# EAGLE design CMM.PCB.v1.0 (EAGLE 9.6.2)
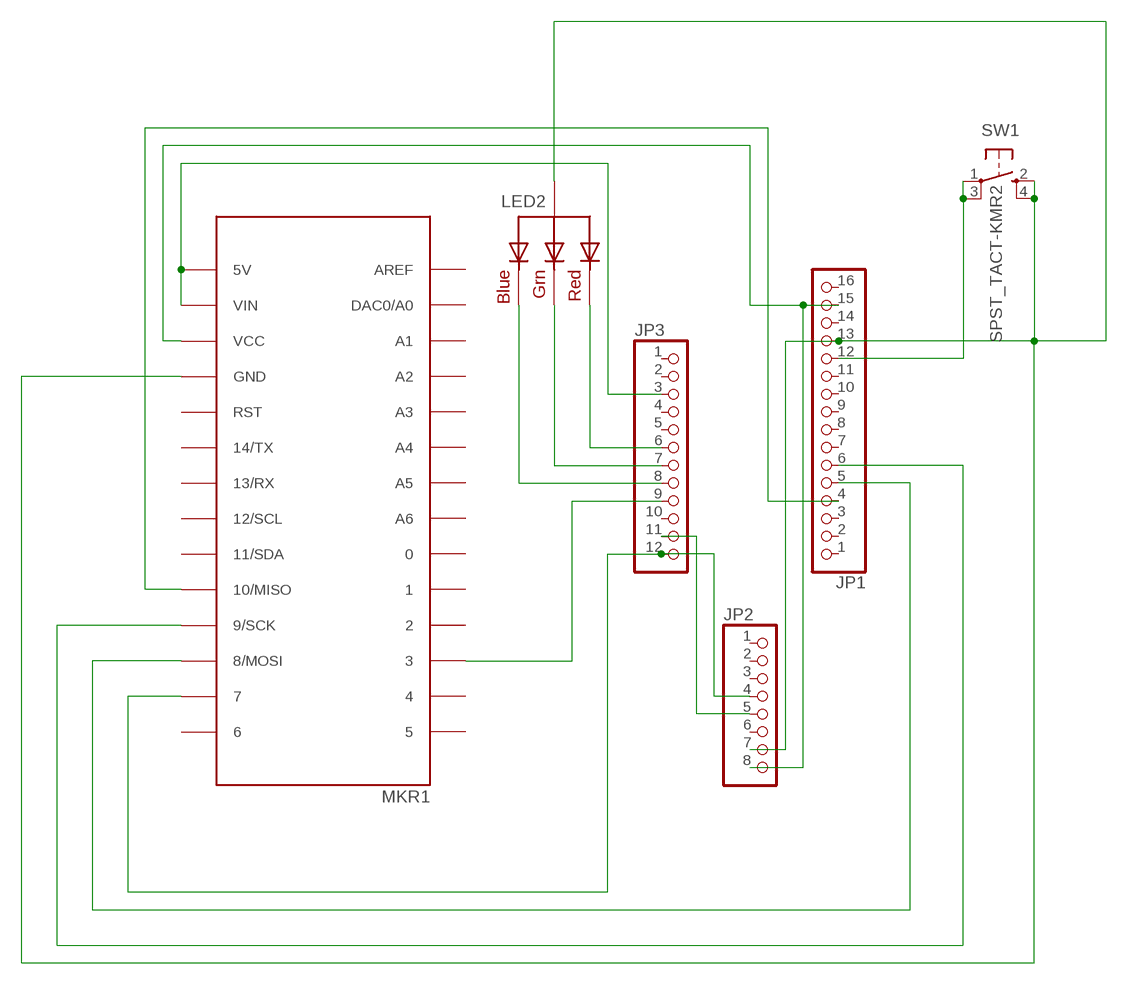
[diagram p0: schematic, sheet 1]

## Parts
JP1  HEADER-1X16ROUND  [1X16_ROUND]
JP2  HEADER-1X870MIL  [1X08_ROUND_70]
JP3  HEADER-1X12  [1X12_ROUND]
LED2  RGBLED_CA-5MM  [LED5MMRGB]
MKR1  -  ARDUINO-UTILITY_MKRBOARDOUTLINE  [ARDUINO-UTILITY_MKRBOARD]
SW1  SPST_TACT-KMR2  [KMR2]

## Nets
GND: JP1.13 JP2.7 LED2.2(VCC) MKR1.GND SW1.2(S) SW1.4(S1)
N$1: JP3.9 MKR1.3
N$2: JP2.4 JP3.12 MKR1.7
N$3: JP1.5 MKR1.8(8/MOSI)
N$4: JP1.6 MKR1.9(9/SCK)
N$5: JP1.4 MKR1.10(10/MISO)
N$6: JP1.15 JP2.8 MKR1.VCC
N$7: JP3.3 MKR1.5V MKR1.VIN
N$8: JP3.6 LED2.1(RED)
N$9: JP2.5 JP3.11
N$10: JP3.7 LED2.3(GREEN)
N$11: JP3.8 LED2.4(BLUE)
SIGNAL: JP1.12 SW1.1(P) SW1.3(P1)
Unconnected: JP1.1 JP1.2 JP1.3 JP1.7 JP1.8 JP1.9 JP1.10 JP1.11 JP1.14 JP1.16 JP2.1 JP2.2 JP2.3 JP2.6 JP3.1 JP3.2 JP3.4 JP3.5 JP3.10 MKR1.0 MKR1.1 MKR1.2 MKR1.4 MKR1.5 MKR1.6 MKR1.11(11/SDA) MKR1.12(12/SCL) MKR1.13(13/RX) MKR1.14(14/TX) MKR1.A0(DAC0/A0) MKR1.A1 MKR1.A2 MKR1.A3 MKR1.A4 MKR1.A5 MKR1.A6 MKR1.AREF MKR1.RST

## Library data of the parts
JP1 = microbuilder:HEADER-1X16: PIN HEADER
JP2 = microbuilder:HEADER-1X8: PIN HEADER
JP3 = microbuilder:HEADER-1X12
LED2 = adafruit:RGBLED_CA: RGB LED, common-anode 5MM Staggered pins 5mm Piranha package http://www.ladyada.net/library/pcb/eaglelibrary.html
MKR1 = adafruit:ARDUINO-UTILITY_MKRBOARD: MKR board footprint; CODE-ARDUINO: A5272 A5273; DATASHEET: -; DISTRIBUTOR-LINK: -; DISTRIBUTOR-PN: -; MANUFACTURER: -; MANUFACTURER-PN: 21TW331 21TW332
SW1 = adafruit:SPST_TACT: SMT 6mm switch, EVQQ2 series http://www.ladyada.net/library/eagle

## Board
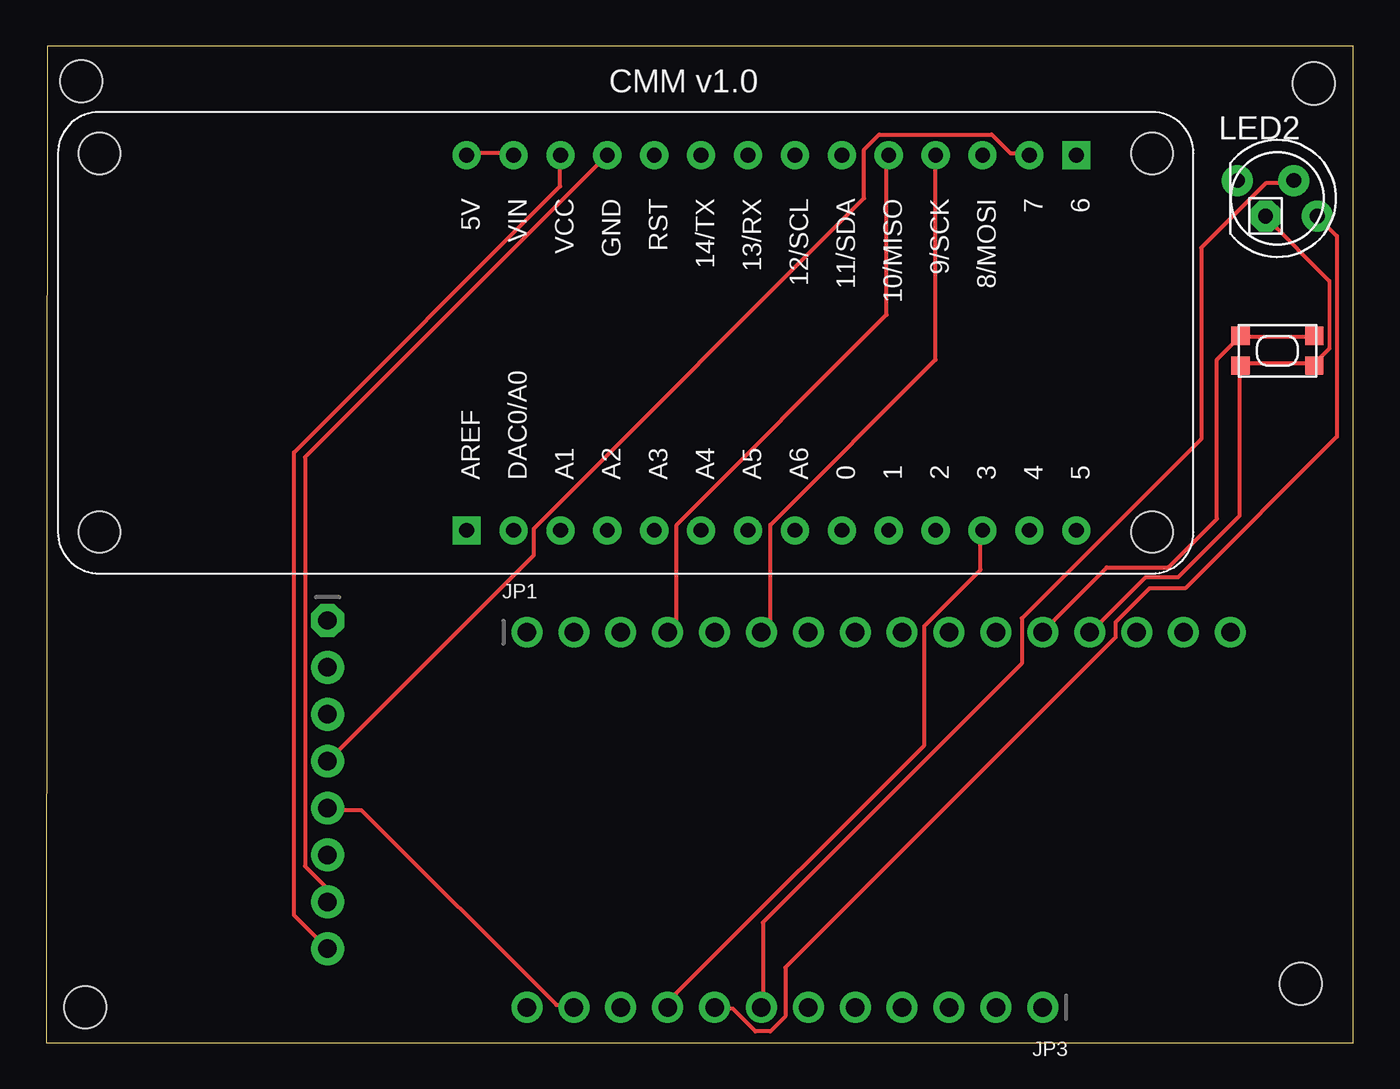
[diagram p1: board, top side]
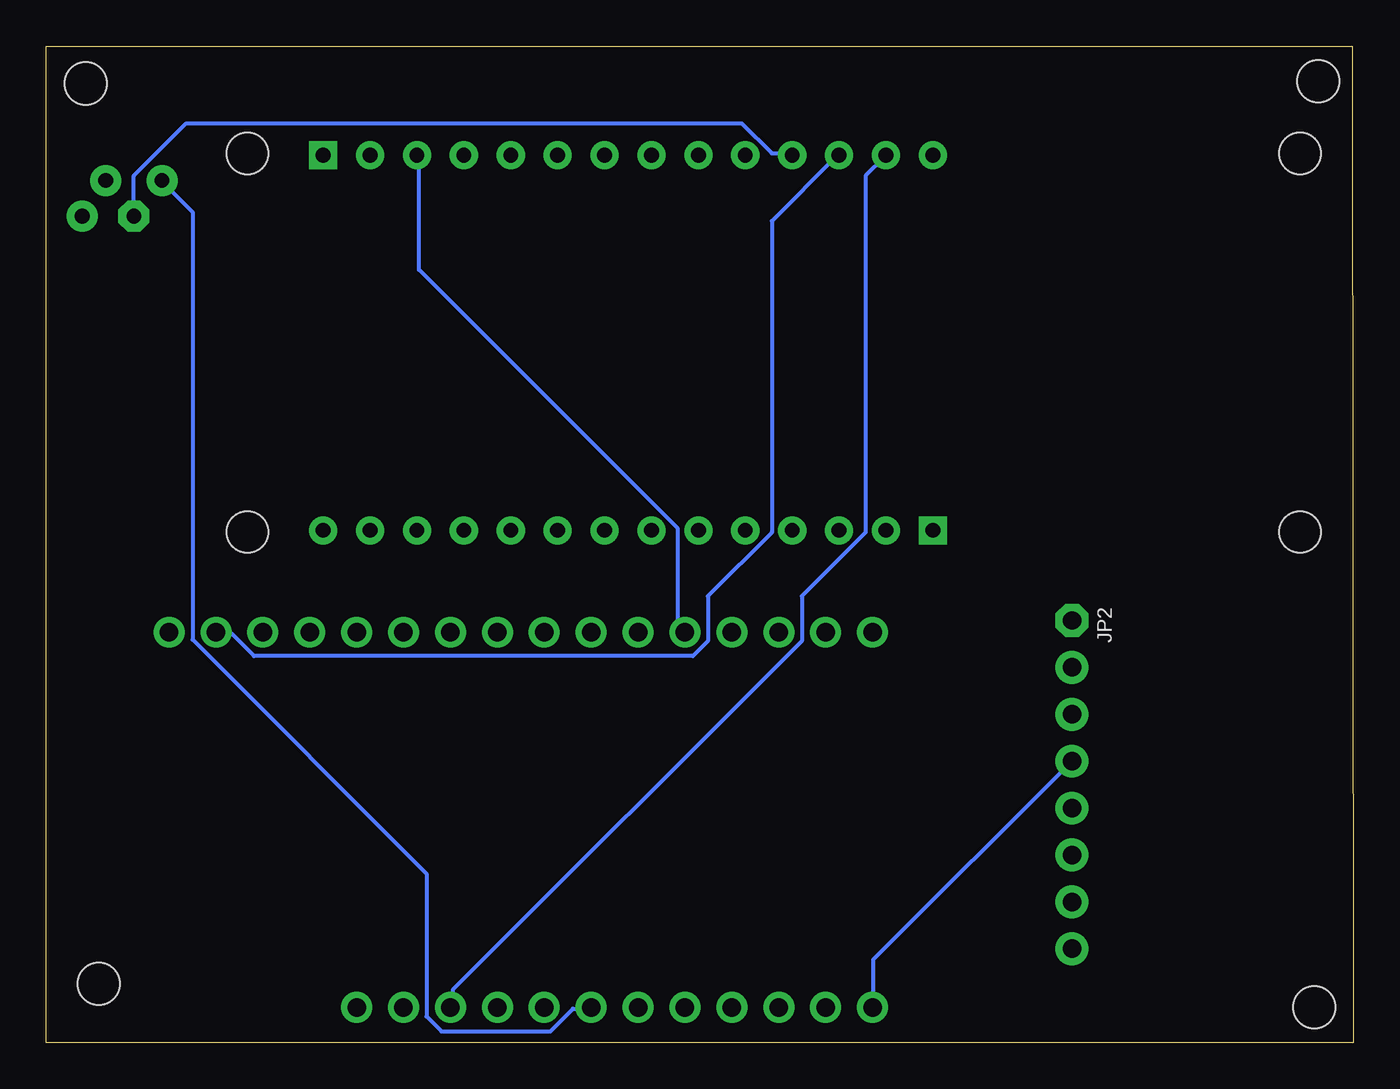
[diagram p2: board, bottom side, seen from below]

Size 70.79 x 53.97 mm. Coordinates in mm from the lower left corner, seen from the top.
Outline: 0,0 70.79,0 70.79,53.97 0.06,53.97 0,0
Copper layers (1*16): Top 0.035mm / dielectric 1.5mm / Bottom 0.035mm
Design rules "default *": minimum track width 8mil, minimum drill 15.5mil, track to track 8mil, track to pad 8mil, pad to pad 8mil, via to via 8mil, smd to smd 8mil, copper to edge 10mil, drill to drill 8mil, minimum pad ring 10mil, minimum via ring 8mil, stop-mask expansion 4mil, vias tented up to drill 20mil, thermal gap 10mil
Holes 2.29 mm at 2.11,1.91 67.94,3.17 1.91,52.07 68.64,51.94

### Footprints (pad centres in the part's own frame; a part is rotated, then mirrored left to right if it is on the bottom)
1X16_ROUND = drill 1 pad 1.676: 1 -19.05,0; 2 -16.51,0; 3 -13.97,0; 4 -11.43,0; 5 -8.89,0; 6 -6.35,0; 7 -3.81,0; 8 -1.27,0; 9 1.27,0; 10 3.81,0; 11 6.35,0; 12 8.89,0; 13 11.43,0; 14 13.97,0; 15 16.51,0; 16 19.05,0
1X08_ROUND_70 = drill 1 pad 1.778 octagon: 1 -8.89,0 | drill 1 pad 1.778: 2 -6.35,0; 3 -3.81,0; 4 -1.27,0; 5 1.27,0; 6 3.81,0; 7 6.35,0; 8 8.89,0
1X12_ROUND = drill 1 pad 1.676: 1 -13.97,0; 2 -11.43,0; 3 -8.89,0; 4 -6.35,0; 5 -3.81,0; 6 -1.27,0; 7 1.27,0; 8 3.81,0; 9 6.35,0; 10 8.89,0; 11 11.43,0; 12 13.97,0
LED5MMRGB = drill 0.8 pad 1.676: 1 -2.159,0.968; 3 0.889,0.968; 4 2.159,-0.968 | drill 0.8 pad 1.676 octagon: 2 -0.635,-0.968
ARDUINO-UTILITY_MKRBOARD = drill 0.8 pad 1.524: 0 42.455,2.34; 1 44.995,2.34; 2 47.535,2.34; 3 50.075,2.34; 4 52.615,2.34; 5 55.155,2.34; 5V 22.135,22.66; 7 52.615,22.66; 8 50.075,22.66; 9 47.535,22.66; 10 44.995,22.66; 11 42.455,22.66; 12 39.915,22.66; 13 37.375,22.66; 14 34.835,22.66; A0 24.675,2.34; A1 27.215,2.34; A2 29.755,2.34; A3 32.295,2.34; A4 34.835,2.34; A5 37.375,2.34; A6 39.915,2.34; GND 29.755,22.66; RST 32.295,22.66; VCC 27.215,22.66; VIN 24.675,22.66 | drill 0.8 pad 1.524 square: 6 55.155,22.66; AREF 22.135,2.34 | hole 2.25: 59.25,2.25; 59.25,22.75; 2.25,2.25; 2.25,22.75
KMR2 = smd 1 x 1: 1 2,0.8; 2 2,-0.8; 3 -2,0.8; 4 -2,-0.8

### Placement (x,y rotation side)
JP1  45.09,22.23 0 top
JP2  15.24,13.97 270 top
JP3  40.01,1.91 180 top
LED2  66.67,45.72 0 top
MKR1  0.64,25.4 0 top
SW1  66.67,37.47 0 top

### Tracks (layer width: path | path; a pad name or v marks a point on that pad's centre or on a via)
GND
  Top 0.203: LED2.2 66.04,44.7 69.49,41.25 69.49,37.59 68.68,36.78 SW1.2 68.48,36.78 64.82,36.78 SW1.4 64.62,36.58 64.62,28.52 61.29,25.2 59.54,25.2 56.69,22.35 JP1.13 | JP2.7 15.24,8.33 14.02,9.55 14.02,31.7 30.28,47.95 MKR1.GND
  Bottom 0.203: LED2.2 66.04,46.94 63.2,49.78 33.12,49.78 31.5,48.16 30.48,48.16 MKR1.GND
N$1
  Top 0.203: MKR1.3 50.6,27.64 50.6,25.6 47.55,22.55 47.55,16.1 34.11,2.67 JP3.9
N$2
  Top 0.203: JP2.4 26.42,26.42 26.42,27.84 44.3,45.72 44.3,48.36 45.11,49.17 51.21,49.17 52.22,48.16 53.24,48.16 MKR1.7
  Bottom 0.203: JP2.4 26.01,4.47 26.01,2.03 JP3.12
N$3
  Bottom 0.203: MKR1.8 50.6,47.95 50.6,41.86 36.58,27.84 36.58,22.55 36.37,22.35 JP1.5
N$4
  Top 0.203: MKR1.9 48.16,47.95 48.16,36.98 39.22,28.04 39.22,22.76 38.81,22.35 JP1.6
N$5
  Top 0.203: MKR1.10 45.52,47.95 45.52,39.42 34.14,28.04 34.14,22.76 33.73,22.35 JP1.4
N$6
  Top 0.203: JP2.8 13.42,6.9 13.42,31.97 27.84,46.38 27.84,47.95 MKR1.VCC
  Bottom 0.203: JP1.15 61.57,22.15 60.76,22.15 59.54,20.93 35.76,20.93 34.95,21.74 34.95,24.18 31.5,27.64 31.5,44.5 28.04,47.95 MKR1.VCC
N$7
  Top 0.203: MKR1.5V 22.96,48.16 25.2,48.16 MKR1.VIN
  Bottom 0.203: JP3.3 48.77,2.03 48.77,2.85 29.87,21.74 29.87,24.18 26.42,27.64 26.42,46.94 25.4,47.95 MKR1.VIN
N$8
  Bottom 0.203: JP3.6 41.45,1.83 42.27,1.83 43.48,0.61 49.38,0.61 50.19,1.42 50.19,9.14 62.87,21.82 62.87,44.98 64.41,46.53 LED2.1
N$9
  Top 0.203: JP3.11 28.45,2.03 27.64,2.03 17.07,12.6 15.24,12.6 JP2.5
N$10
  Top 0.203: JP3.7 38.81,2.03 38.81,6.5 52.83,20.52 52.83,22.97 62.55,32.69 62.55,43.04 66.04,46.53 67.46,46.53 LED2.3
N$11
  Top 0.203: JP3.8 36.37,1.83 37.19,1.83 38.41,0.61 39.22,0.61 40.03,1.42 40.03,4.06 57.91,21.95 57.91,22.76 59.75,24.6 61.68,24.6 69.9,32.82 69.9,43.69 68.89,44.7 LED2.4
SIGNAL
  Top 0.203: SW1.1 68.48,38.2 64.82,38.2 SW1.3 64.62,38.2 63.4,36.98 63.4,28.36 60.77,25.73 57.43,25.73 54.05,22.35 JP1.12

### Text on the board
tNames: CMM v1.0